# Altium schematic sheet Peripherals.SchDoc
size A; SheetNumber: 5; SheetTotal: 5
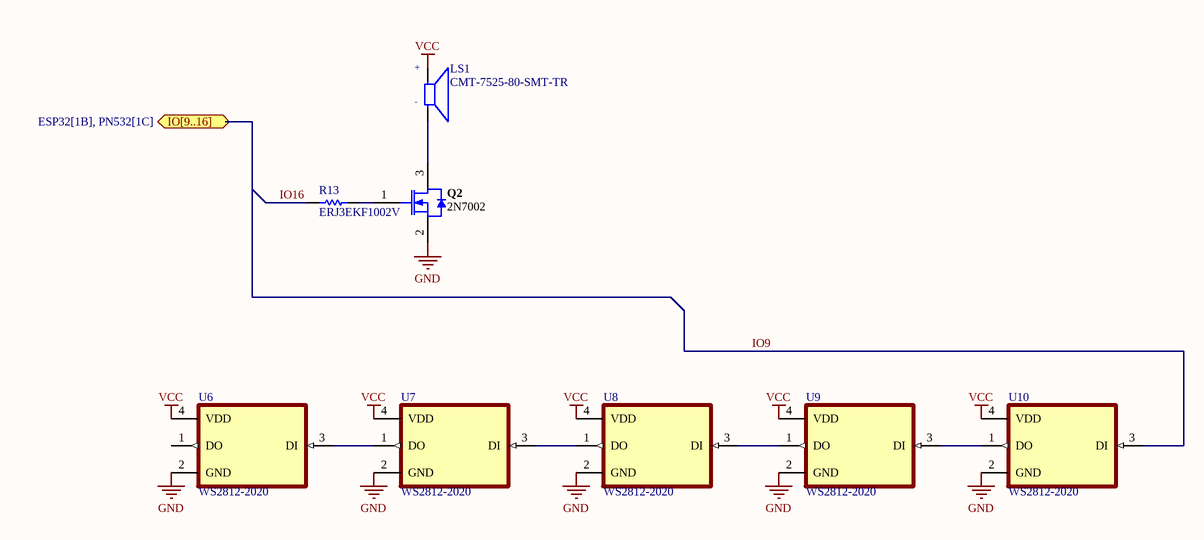
[diagram p0: Peripherals.SchDoc]

## Parts
LS1  CMT-7525-80-SMT-TR  [XDCR_CMT-7525-80-SMT-TR]
Q2  2N7002  [INF-PG-SOT23_M]
R13  ERJ3EKF1002V  [RESC1609X55X30LL15T15]
U6  WS2812-2020  [LED_WS2812-2020]
U7  WS2812-2020  [LED_WS2812-2020]
U8  WS2812-2020  [LED_WS2812-2020]
U9  WS2812-2020  [LED_WS2812-2020]
U10  WS2812-2020  [LED_WS2812-2020]

## Ports
IO[9..16] (bidir, see ESP32[1B], PN532[1C])

## Nets
GND: Q2.2(SOURCE) U6.2(GND) U7.2(GND) U8.2(GND) U9.2(GND) U10.2(GND)
VCC: LS1.P U6.4(VDD) U7.4(VDD) U8.4(VDD) U9.4(VDD) U10.4(VDD)
IO9: U10.3(DI)
IO16: R13.1
NetLS1_N: LS1.N Q2.3(DRAIN)
NetQ2_1: Q2.1(GATE) R13.2
NetU6_3: U6.3(DI) U7.1(DO)
NetU7_3: U7.3(DI) U8.1(DO)
NetU8_3: U8.3(DI) U9.1(DO)
NetU9_3: U9.3(DI) U10.1(DO)

Not connected (* = marked no-connect by the designer): U6 1(DO)

## Notes on the sheet
- (in symbol CMT-7525-80-SMT-TR) +; -

## Library data of the parts
LS1 = CMT-7525-80-SMT-TR: MF: {'manufacturer': u'CUI Devices'}; Package: None; Price: None; Value: *; MP: CMT-7525-80-SMT-TR; Availability: Unavailable
Q2 = CMP-1149-00026-1: N-Channel OptiMOS Small-Signal-Transistor, 60 V VDS, 0.3 A ID, -55 to 150 degC, PG-SOT23, Reel, Green; Manufacturer: Infineon; RDS (on) (max) (@4.5V): 4,000 mOhm; VDS (max): 60 V; IDpuls (max): 1.2Â A; QG: 0.4Â nC; RDS (on) (max): 3,000 mOhm; RthJA (max): 250 K/W; ID (max): 0.3Â A; VGS(th) (max): 2.5Â V; VGS(th) (min): 1.5Â V; Green: TRUE; Ptot (max): 0.5Â W; PackageDescription: 3-Pin Small Outline Transistor Package, 2.9 x 1.3 mm Body, 0.95 mm Pitch; Halogen-free: TRUE; ComponentLink2Description: Datasheet; ComponentLink1URL: http://www.infineon.com/; Packing: Reel; DatasheetVersion: Rev. 2.4; PartNumber: 2N7002; PackageReference: PG-SOT23; PackageVersion: Apr-08; ComponentLink3URL: http://www.infineon.com/dgdl/SOT23-Package_Overview.pdf?folderId=db3a30431936bc4b0119532290053c66&fileId=db3a30431936bc4b0119533468123c85; ComponentLink1Description: Manufacturer URL; Mounting Technology: Surface Mount; ComponentLink3Description: Package Specification; ComponentLink2URL: http://www.infineon.com/dgdl/2N7002_Rev2.4.pdf?folderId=db3a3043156fd573011622e10b5c1f67&fileId=db3a304319bc939a0119c2a9461e79e6
R13 = CMP-1012-00623-3: Chip Resistor, 10 KOhm, +/- 1%, 0.1 W, -55 to 155 degC, 0603 (1608 Metric), RoHS, Tape and Reel; Manufacturer: Panasonic; Voltage Rating: 75V; Case\/Package: 0603; Power Rating: 100mW; Resistance: 10KOhm; Temperature Coefficient: 100ppm\/degreesC; Number of Pins: 2; Package Reference: 603; Depth: 0.8mm; Mount: SurfaceMount; Package Description: 2-Pin Surface Mount Device, Body 1.6 x 0.85 mm; Datasheet Version: 02/2017; Length: 1.6mm; Lead Free: LeadFree; Height: 0.45mm; Number of Terminations: 2; Max Power Dissipation: 100mW; Min Operating Temperature: -55degC; Datasheet URL: https://industrial.panasonic.com/cdbs/www-data/pdf/RDA0000/AOA0000C304.pdf; Termination: SMD/SMT; Case Code (Metric): 1608; Case Code (Imperial): 0603; Tolerance: 1%; Max Operating Temperature: 155degC; RoHSCompliant: true; Voltage Rating (DC): 75V; Radiation Hardening: No; Packaging: TapeandReel; Composition: ThickFilm; Mounting Technology: SurfaceMount; Manufacturer URL: http://www.panasonic.com/; Width: 0.031inch; REACH SVHC: NoSVHC; Contact Plating: Tin; Military Standard: Not; Package Quantity: 1
U6-U10 = WS2812-2020: MF: {'manufacturer': u'Worldsemi'}; Package: None; Price: None; Value: *; MP: WS2812-2020; Availability: Unavailable